# EAGLE design thermo_board (EAGLE 6.5.0)
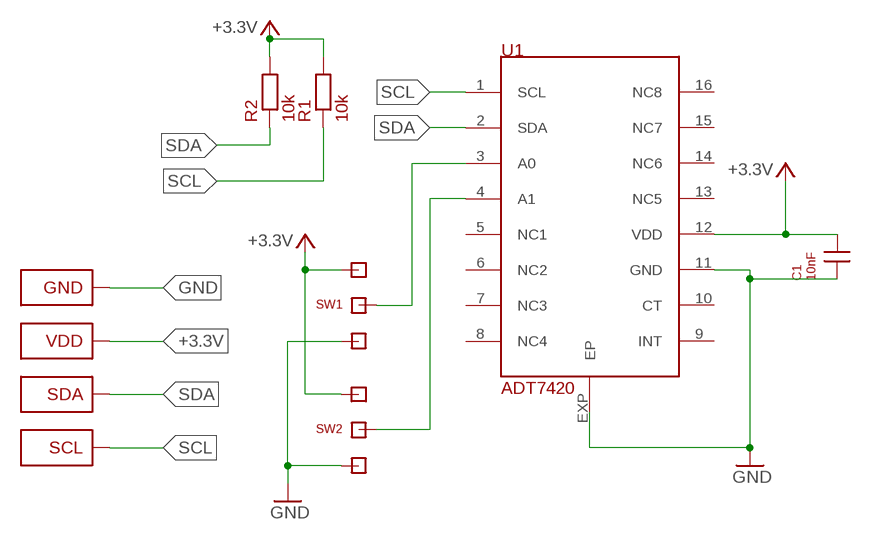
[diagram p0: schematic, sheet 1]

## Parts
C1  10nF  CAPACITOR_CERAMIC_0402  [R0402]
GND  CONN_PAD_SQUARE  [CONN_PAD_SQUARE]
R1  10k  R_0402  [R0402]
R2  10k  R_0402  [R0402]
SCL  CONN_PAD_ROUND  [CONN_PAD_ROUND]
SDA  CONN_PAD_ROUND  [CONN_PAD_ROUND]
SW1  SOLDER_SWITCH_TWO  [SOLDER_SWITCH]
SW2  SOLDER_SWITCH_TWO  [SOLDER_SWITCH]
U1  ADT7420  [LFCSP16]
VDD  CONN_PAD_ROUND  [CONN_PAD_ROUND]

## Nets
+3.3V: C1.2 R1.2 R2.2 SW1.1 SW2.1 U1.12(VDD) VDD.P$1
GND: C1.1 GND.P$1 SW1.2 SW2.2 U1.11(GND) U1.EXP(EP)
N$3: SW1.MID U1.3(A0)
N$4: SW2.MID U1.4(A1)
SCL: R1.1 SCL.P$1 U1.1(SCL)
SDA: R2.1 SDA.P$1 U1.2(SDA)
Unconnected: U1.5(NC1) U1.6(NC2) U1.7(NC3) U1.8(NC4) U1.9(INT) U1.10(CT) U1.13(NC5) U1.14(NC6) U1.15(NC7) U1.16(NC8)

## Library data of the parts
C1 = thermo_lib:CAPACITOR_CERAMIC
GND SCL SDA VDD = thermo_lib:CONN_PAD
R1 R2 = thermo_lib:R
SW1 SW2 = thermo_lib:SOLDER_SWITCH
U1 = thermo_lib:ADT7420

## Board
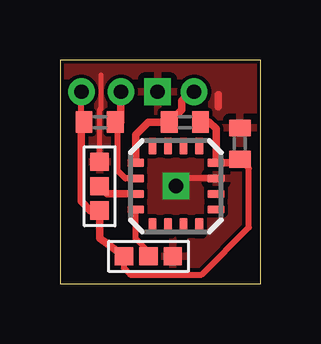
[diagram p1: board, top side]
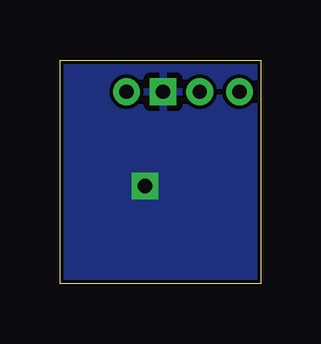
[diagram p2: board, bottom side, seen from below]

Size 8.36 x 9.32 mm. Coordinates in mm from the lower left corner, seen from the top.
Outline: 0,0 8.36,0 8.36,9.32 0,9.32 0,0
Copper layers (1*16): Top 0.035mm / dielectric 1.5mm / Bottom 0.035mm
Design rules "default *": minimum track width 0.2mm, minimum drill 0.5mm, track to track 0.15mm, track to pad 0.15mm, pad to pad 0.15mm, via to via 0.15mm, smd to smd 0.15mm, copper to edge 0.15mm, drill to drill 0.15mm, minimum pad ring 10mil, minimum via ring 8mil, stop-mask expansion 4mil, vias tented up to drill 0mil, thermal gap 10mil

### Footprints (pad centres in the part's own frame; a part is rotated, then mirrored left to right if it is on the bottom)
R0402 = smd 0.7 x 0.9: 1 -0.65,0; 2 0.65,0
CONN_PAD_SQUARE = drill 0.6 square: P$1 0,0
CONN_PAD_ROUND = drill 0.6: P$1 0,0
SOLDER_SWITCH = smd 0.762 x 0.762: 1 -1.016,0; 2 1.016,0; MID 0,0
LFCSP16 = smd 0.7 x 0.35: 1 -1.675,0.975; 2 -1.675,0.325; 3 -1.675,-0.325; 4 -1.675,-0.975; 9 1.675,-0.975; 10 1.675,-0.325; 11 1.675,0.325; 12 1.675,0.975 | smd 0.35 x 0.7: 5 -0.975,-1.675; 6 -0.325,-1.675; 7 0.325,-1.675; 8 0.975,-1.675; 13 0.975,1.675; 14 0.325,1.675; 15 -0.325,1.675; 16 -0.975,1.675 | drill 0.6 square: EXP 0,0

### Placement (x,y rotation side)
C1  7.49,5.84 270 top
GND  4.06,8 0 top
R1  5.21,6.73 0 top
R2  1.65,6.73 180 top
SCL  5.59,8 0 top
SDA  2.54,8 0 top
SW1  1.65,4.06 90 top
SW2  3.68,1.14 0 top
U1  4.83,4.06 0 top
VDD  0.89,8 0 top

### Tracks (layer width: path | path; a pad name or v marks a point on that pad's centre or on a via)
+3.3V
  Top 0.254: 6.22,6.73 R1.2 | R2.2 0.89,6.84 VDD.P$1 | SW2.1 2.67,0.64 2.92,0.38 5.91,0.38 7.87,2.35 7.87,4.81 C1.2
  Top 0.305: 6.22,6.73 6.5,6.45 U1.12 7.34,5.04 C1.2 | 2.54,1.02 SW2.1 1.65,1.91 SW1.1 1.27,3.05 0.89,3.43 0.89,6.49 R2.2 1.02,6.75
GND
  Top 0.2: SW1.2 1.65,7.24 1.71,7.3 1.71,8.7
  Top 0.254: U1.11 5.15,4.39 U1.EXP
  Top 0.305: 6.6,7.38 6.6,7.87
  pour Top: -1.27,-0.51 8.64,-0.51 9.14,10.16 -0.76,10.16
  pour Bottom: -1.27,-1.27 8.64,-1.27 9.14,10.16 -0.76,10.16
N$3
  Top 0.305: U1.3 1.98,3.74 SW1.MID
N$4
  Top 0.254: SW2.MID 3.68,1.33 3.15,1.86 U1.4
SCL
  Top 0.2: R1.1 4.25,6.73
  Top 0.305: U1.1 3.15,6.2 3.68,6.73 R1.1 5.08,7.25 5.08,7.62 5.46,8 SCL.P$1
SDA
  Top 0.2: 2.54,6.49 R2.1
  Top 0.254: U1.2 2.72,4.39 2.41,4.7 2.41,6.73 R2.1
  Top 0.305: R2.1 2.54,6.73 SDA.P$1